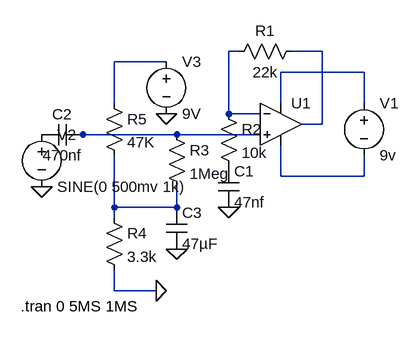
[diagram p0: schematic preamp.asc]
preamp.asc, the LTspice schematic file:
Version 4
SHEET 1 880 680
WIRE 176 48 160 48
WIRE 304 48 256 48
WIRE 64 64 -16 64
WIRE 368 80 240 80
WIRE -16 128 -16 64
WIRE 240 128 240 80
WIRE 368 128 368 80
WIRE 160 144 160 48
WIRE 208 144 160 144
WIRE 304 160 304 48
WIRE 304 160 272 160
WIRE -64 176 -80 176
WIRE 80 176 -64 176
WIRE 208 176 80 176
WIRE 240 240 240 192
WIRE 368 240 368 208
WIRE 368 240 240 240
WIRE -16 288 -16 208
WIRE 80 288 80 256
WIRE 80 288 -16 288
WIRE -16 304 -16 288
WIRE -16 416 -16 384
WIRE 48 416 -16 416
FLAG 160 288 0
FLAG -128 256 0
FLAG 80 352 0
FLAG 64 144 0
FLAG 48 416 0
SYMBOL OpAmps\\UniversalOpAmp1 240 160 R0
SYMATTR InstName U1
SYMBOL voltage 368 112 R0
WINDOW 123 0 0 Left 0
WINDOW 39 0 0 Left 0
SYMATTR InstName V1
SYMATTR Value 9v
SYMBOL res 272 32 R90
WINDOW 0 0 56 VBottom 2
WINDOW 3 32 56 VTop 2
SYMATTR InstName R1
SYMATTR Value 22k
SYMBOL res 144 128 R0
SYMATTR InstName R2
SYMATTR Value 10k
SYMBOL cap 144 224 R0
SYMATTR InstName C1
SYMATTR Value 47nf
SYMBOL cap -64 160 R90
WINDOW 0 0 32 VBottom 2
WINDOW 3 32 32 VTop 2
SYMATTR InstName C2
SYMATTR Value 470nf
SYMBOL voltage -128 160 R0
WINDOW 123 0 0 Left 0
WINDOW 39 0 0 Left 0
SYMATTR InstName V2
SYMATTR Value SINE(0 500mv 1k)
SYMBOL res 64 160 R0
SYMATTR InstName R3
SYMATTR Value 1Meg
SYMBOL cap 64 288 R0
SYMATTR InstName C3
SYMATTR Value 47µF
SYMBOL res -32 288 R0
SYMATTR InstName R4
SYMATTR Value 3.3k
SYMBOL res -32 112 R0
SYMATTR InstName R5
SYMATTR Value 47K
SYMBOL voltage 64 48 R0
WINDOW 123 0 0 Left 0
WINDOW 39 0 0 Left 0
SYMATTR InstName V3
SYMATTR Value 9V
TEXT -160 440 Left 2 !.tran 0 5MS 1MS

The netlist it stands for:
* preamp.asc
XU1 N005 N001 N004 N006 N002 level1 Avol=1Meg GBW=10Meg Vos=0 En=0 Enk=0 In=0 Ink=0 Rin=500Meg  ; pins In+ In- V+ V- OUT
V1 N004 N006 9v
R1 N002 N001 22k
R2 N001 P001 10k
C1 P001 0 47nf
C2 N005 P002 470nf
V2 P002 0 SINE(0 500mv 1k)
R3 N005 N007 1Meg
C3 N007 0 47µF
R4 N007 0 3.3k
R5 N003 N007 47K
V3 N003 0 9V
.tran 0 5MS 1MS
.lib UniversalOpAmp1.lib
.backanno
.end